# EAGLE design thermo (EAGLE 9.6.1)
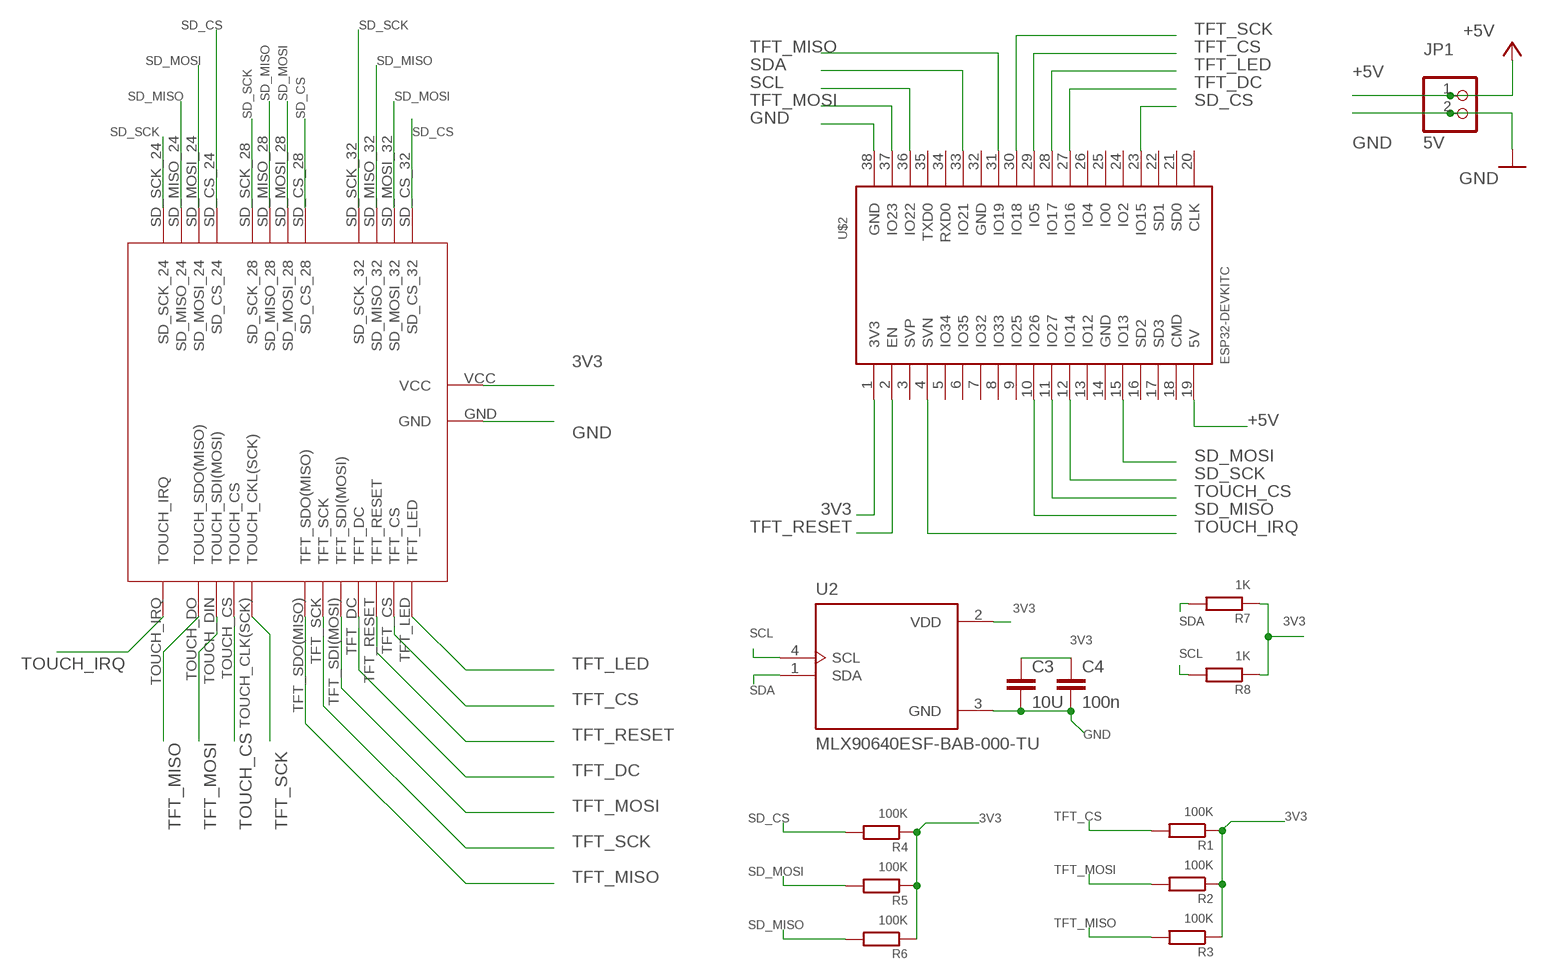
[diagram p0: schematic, sheet 1]

## Parts
C3  10U  C2,5-3  [C2.5-3]
C4  100n  C2,5-3  [C2.5-3]
JP1  5V  PINHD-1X2  [1X02]
R1  100K  R-EU_0204/7  [0204/7]
R2  100K  R-EU_0204/7  [0204/7]
R3  100K  R-EU_0204/7  [0204/7]
R4  100K  R-EU_0204/7  [0204/7]
R5  100K  R-EU_0204/7  [0204/7]
R6  100K  R-EU_0204/7  [0204/7]
R7  1K  R-EU_0204/7  [0204/7]
R8  1K  R-EU_0204/7  [0204/7]
U2  MLX90640ESF-BAB-000-TU  [TO292P945H1165-4]
U$2  ESP32DEVKITC  [ESP32-DEVKITC]
U$3  ILI9341_DISPLAY_SD_MODULE  [ILI9341_DISPLAY_SD_MODULE]

## Nets
3V3 [supply]: C3.1 C4.1 R1.1 R2.1 R3.1 R4.1 R5.1 R6.1 R7.1 R8.1 U2.2(VDD) U$2.1(3V3) U$3.VCC
+5V [supply]: JP1.1 U$2.19(5V)
GND [supply]: C3.2 C4.2 JP1.2 U2.3(GND) U$2.38(GND) U$3.GND
SCL: R8.2 U2.4(SCL) U$2.36(IO22)
SD_CS: R4.2 U$2.23(IO15) U$3.SD_CS_24 U$3.SD_CS_28 U$3.SD_CS_32
SD_MISO: R6.2 U$2.10(IO26) U$3.SD_MISO_24 U$3.SD_MISO_28 U$3.SD_MISO_32
SD_MOSI: R5.2 U$2.15(IO13) U$3.SD_MOSI_24 U$3.SD_MOSI_28 U$3.SD_MOSI_32
SD_SCK: U$2.12(IO14) U$3.SD_SCK_24 U$3.SD_SCK_28 U$3.SD_SCK_32
SDA: R7.2 U2.1(SDA) U$2.33(IO21)
TFT_CS: R1.2 U$2.29(IO5) U$3.TFT_CS
TFT_DC: U$2.27(IO16) U$3.TFT_DC
TFT_LED: U$2.28(IO17) U$3.TFT_LED
TFT_MISO: R3.2 U$2.31(IO19) U$3.TFT_SDO(MISO) U$3.TOUCH_DO(TOUCH_SDO(MISO))
TFT_MOSI: R2.2 U$2.37(IO23) U$3.TFT_SDI(MOSI) U$3.TOUCH_DIN(TOUCH_SDI(MOSI))
TFT_RESET: U$2.2(EN) U$3.TFT_RESET
TFT_SCK: U$2.30(IO18) U$3.TFT_SCK U$3.TOUCH_CLK(SCK)(TOUCH_CKL(SCK))
TOUCH_CS: U$2.11(IO27) U$3.TOUCH_CS
TOUCH_IRQ: U$2.4(SVN) U$3.TOUCH_IRQ
Unconnected: U$2.3(SVP) U$2.5(IO34) U$2.6(IO35) U$2.7(IO32) U$2.8(IO33) U$2.9(IO25) U$2.13(IO12) U$2.14(GND) U$2.16(SD2) U$2.17(SD3) U$2.18(CMD) U$2.20(CLK) U$2.21(SD0) U$2.22(SD1) U$2.24(IO2) U$2.25(IO0) U$2.26(IO4) U$2.32(GND) U$2.34(RXD0) U$2.35(TXD0)

## Library data of the parts
C3 C4 = capacitor-wima:C: CAPACITOR naming: grid - package width
JP1 = pinhead:PINHD-1X2: PIN HEADER
R1-R8 = rcl:R-EU_: RESISTOR, European symbol; SPICEPREFIX: R
U2 = teploblinEkran:MLX90640ESF-BAB-000-TU: SENSOR DGTL -40C-85C TO39; AVAILABILITY: Unavailable; DESCRIPTION: Thermal Image Sensor 32H x 24V TO-39; MF: Melexis Technologies NV; MP: MLX90640ESF-BAB-000-TU; PACKAGE: TO-39 Melexis Technologies NV; PRICE: None
U$2 = teploblinEkran:ESP32DEVKITC
U$3 = thermo:ILI9341_DISPLAY_SD_MODULE

## Net classes
1 supply: width 0.813 mm

## Board
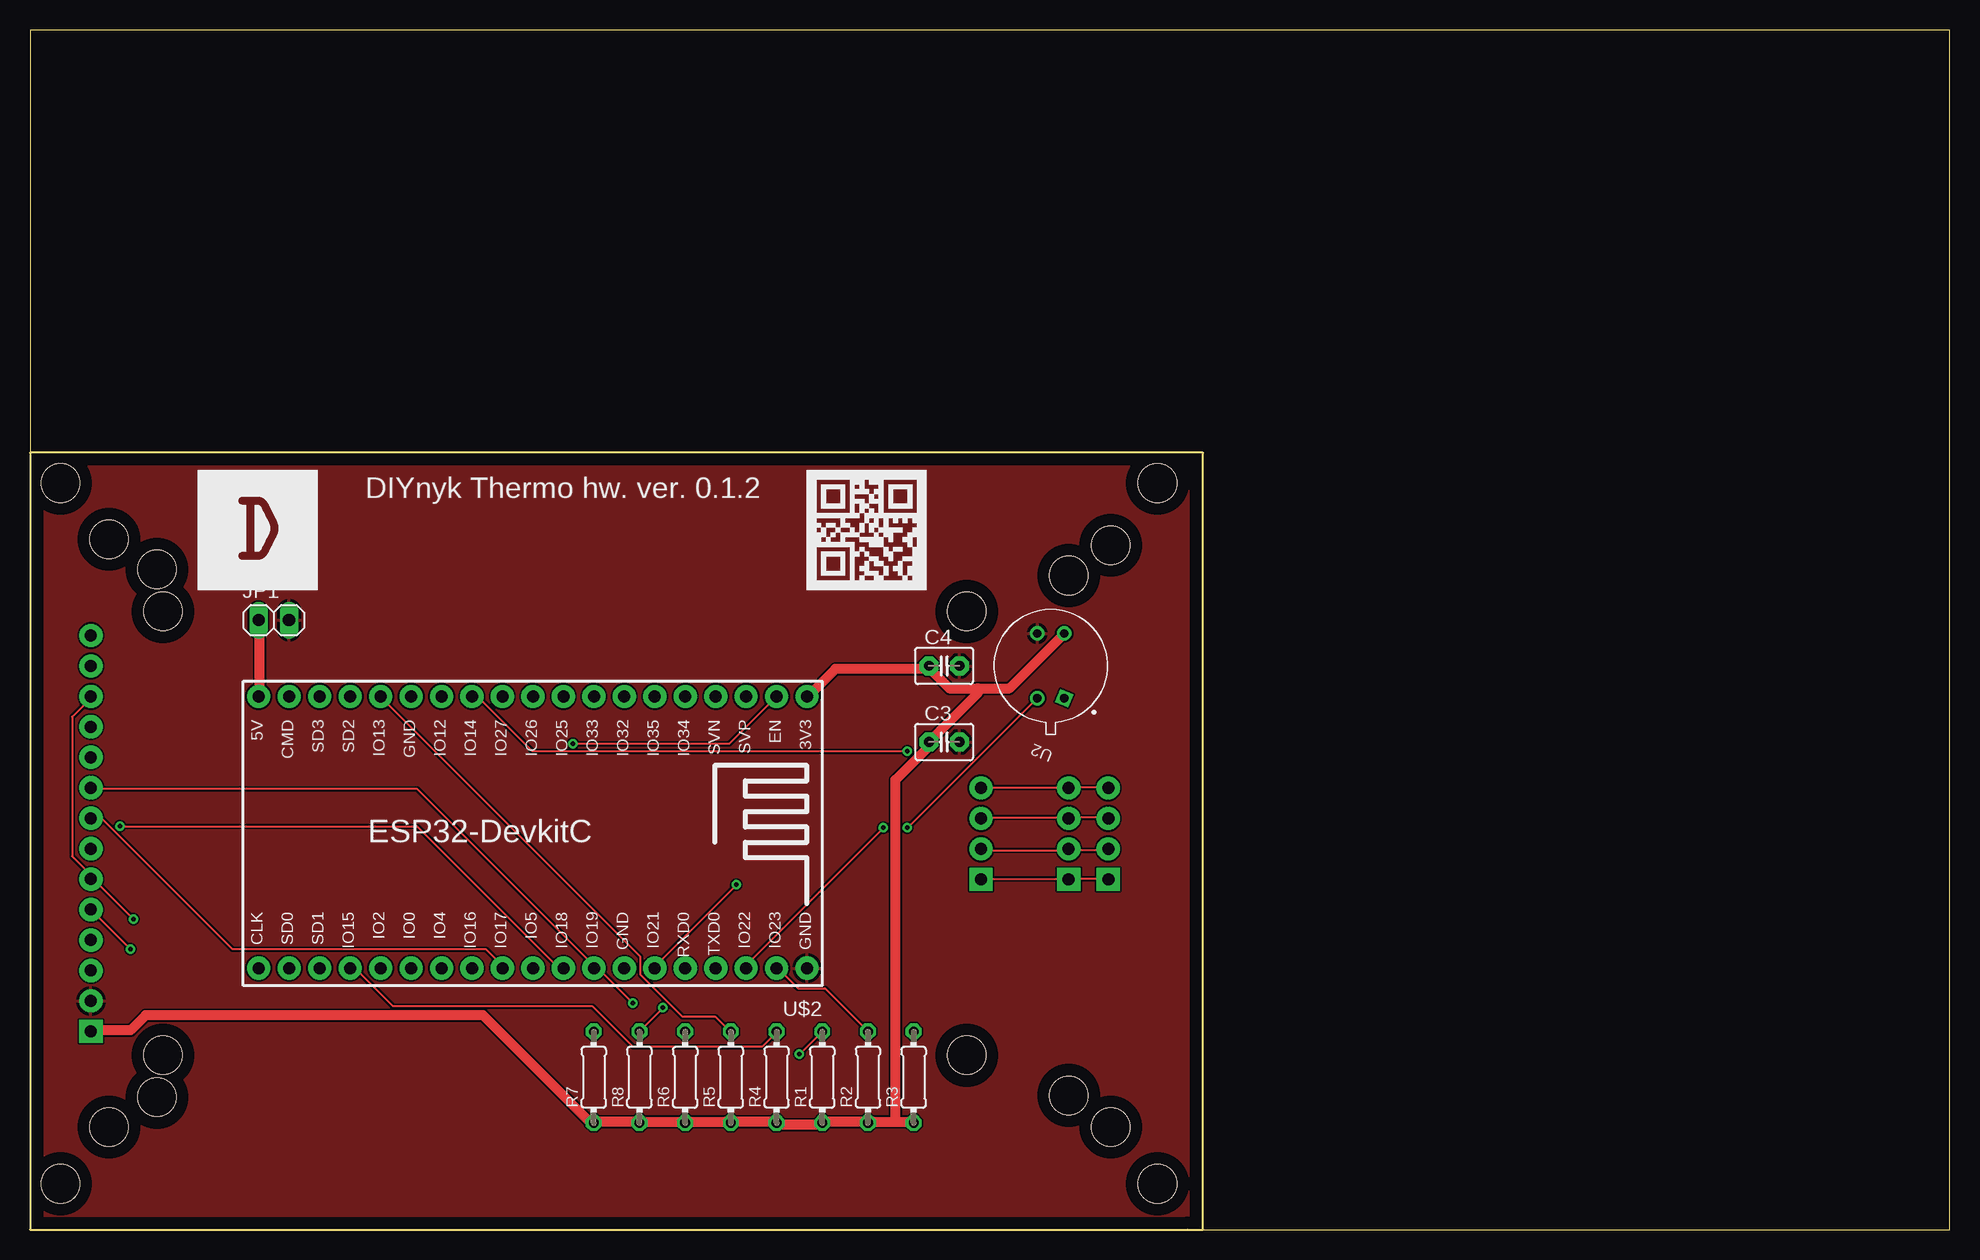
[diagram p1: board, top side]
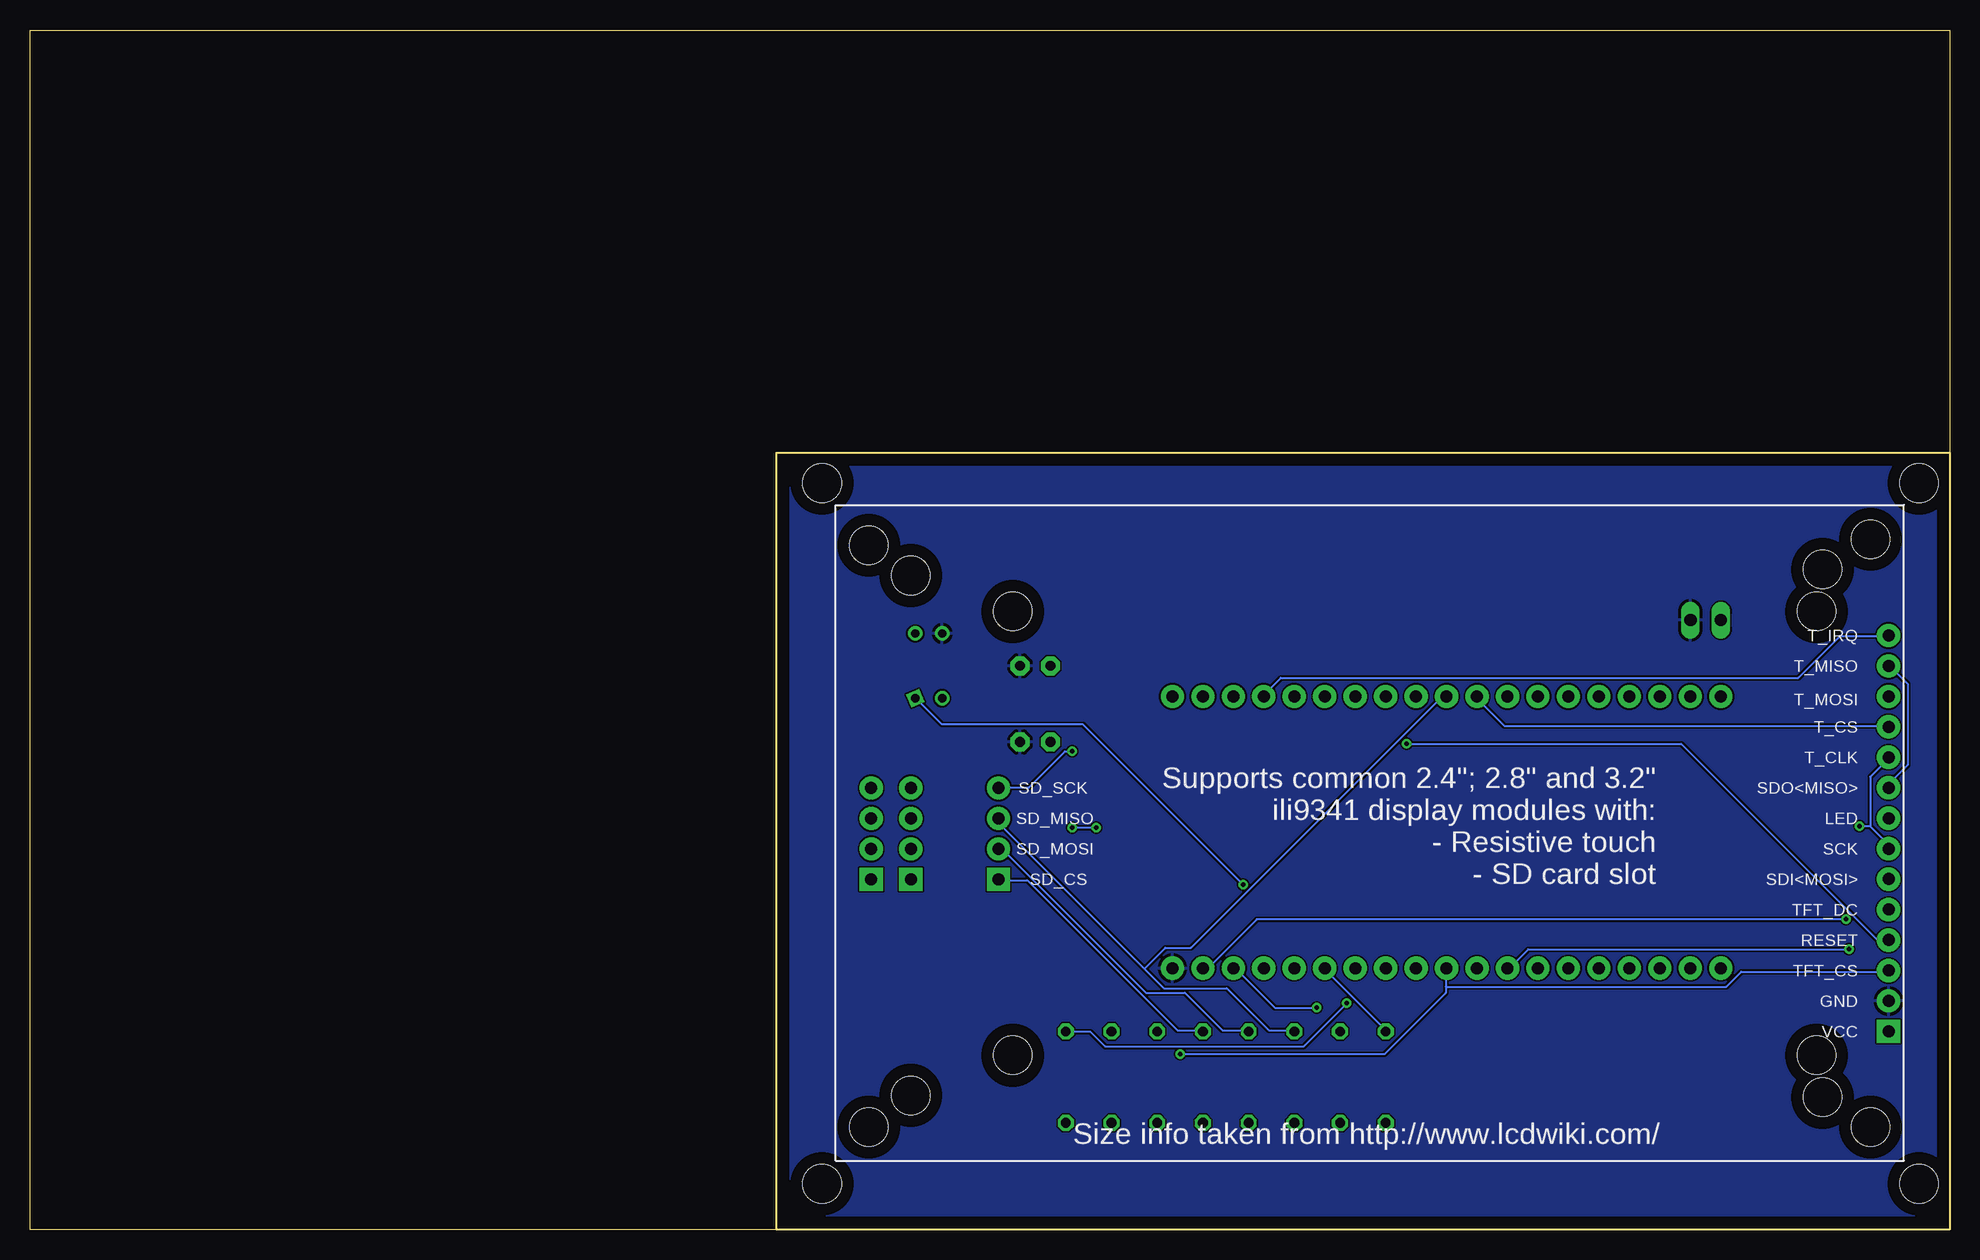
[diagram p2: board, bottom side, seen from below]

Size 160 x 100 mm. Coordinates in mm from the lower left corner, seen from the top.
Outline: 96.52,0 160,0 160,100 0,100 0,64.77
Outline: 96.52,0 0,0 0,64.77
Outline: 96.52,0 97.79,0 97.79,64.77 0,64.77
Copper layers (1*16): Top 0.035mm / dielectric 1.5mm / Bottom 0.035mm
Design rules "default": minimum track width 6mil, minimum drill 0.35mm, track to track 6mil, track to pad 6mil, pad to pad 6mil, via to via 6mil, smd to smd 6mil, copper to edge 40mil, drill to drill 6mil, minimum pad ring 10mil, minimum via ring 8mil, stop-mask expansion 4mil, vias tented up to drill 0mil, thermal gap 10mil
Holes 3.2 mm at 2.54,3.81 93.98,3.81 93.98,62.23 2.54,62.23

### Footprints (pad centres in the part's own frame; a part is rotated, then mirrored left to right if it is on the bottom)
C2.5-3 = drill 0.813 pad 1.6 octagon: 1 -1.27,0; 2 1.27,0
1X02 = drill 1.016 long: 1 -1.27,0; 2 1.27,0
0204/7 = drill 0.813 octagon: 1 -3.81,0; 2 3.81,0
TO292P945H1165-4 = drill 0.7 pad 1.1 square: 1 -2.065,2.067 | drill 0.7 pad 1.1: 2 0,-2.92; 3 2.065,-2.065; 4 0,2.92
ESP32-DEVKITC = drill 1 pad 1.93: 1 -22.87,-11.42; 2 -20.33,-11.42; 3 -17.79,-11.42; 4 -15.25,-11.42; 5 -12.71,-11.42; 6 -10.17,-11.42; 7 -7.63,-11.42; 8 -5.09,-11.42; 9 -2.55,-11.42; 10 -0.01,-11.42; 11 2.53,-11.42; 12 5.07,-11.42; 13 7.61,-11.42; 14 10.15,-11.42; 15 12.69,-11.42; 16 15.23,-11.42; 17 17.77,-11.42; 18 20.31,-11.42; 19 22.85,-11.42; 20 22.85,11.23; 21 20.31,11.23; 22 17.77,11.23; 23 15.23,11.23; 24 12.69,11.23; 25 10.15,11.23; 26 7.61,11.23; 27 5.07,11.23; 28 2.53,11.23; 29 -0.01,11.23; 30 -2.55,11.23; 31 -5.09,11.23; 32 -7.63,11.23; 33 -10.17,11.23; 34 -12.71,11.23; 35 -15.25,11.23; 36 -17.79,11.23; 37 -20.33,11.23; 38 -22.87,11.23
ILI9341_DISPLAY_SD_MODULE = drill 1 pad 1.93: GND -30.48,0; SD_MISO_24 -15.26,74.18; SD_MISO_28 -15.26,81.5; SD_MISO_32 -15.26,84.8; SD_MOSI_24 -17.8,74.18; SD_MOSI_28 -17.8,81.5; SD_MOSI_32 -17.8,84.8; SD_SCK_24 -12.72,74.18; SD_SCK_28 -12.72,81.5; SD_SCK_32 -12.72,84.8; TFT_CS -27.94,0; TFT_DC -22.86,0; TFT_LED -15.24,0; TFT_RESET -25.4,0; TFT_SCK -17.78,0; TFT_SDI(MOSI) -20.32,0; TFT_SDO(MISO) -12.7,0; TOUCH_CLK(SCK) -10.16,0; TOUCH_CS -7.62,0; TOUCH_DIN -5.08,0; TOUCH_DO -2.54,0; TOUCH_IRQ -0.02,0 | drill 1 pad 1.93 square: SD_CS_24 -20.34,74.18; SD_CS_28 -20.34,81.5; SD_CS_32 -20.34,84.8; VCC -33,0 | hole 3.2: 8.01,1.5; -40.99,1.5; -40.99,85; 7.51,85; 4.99,81.5; -38.35,81.5; -38.5,5.5; 5.5,5.5; -35,6; 2,6; -35,73; 2,73

### Placement (x,y rotation side)
C3  76.2,40.64 0 top
C4  76.2,46.99 0 top
JP1  20.32,50.8 0 top
R1  66.04,12.7 90 top
R2  69.85,12.7 90 top
R3  73.66,12.7 90 top
R4  62.23,12.7 90 top
R5  58.42,12.7 90 top
R6  54.61,12.7 90 top
R7  46.99,12.7 90 top
R8  50.8,12.7 90 top
U2  85.09,46.99 157.5 top
U$1  [DIYNYK_10MM]  13.97,53.34 0 top
U$2  41.91,33.02 180 top
U$3  5.08,49.53 90 bottom
U$4  [QR_10MM]  64.77,53.34 0 top

### Tracks (layer width: path | path; a pad name or v marks a point on that pad's centre or on a via)
3V3
  Top 0.813: 79,45.12 76.62,45.12 74.88,46.88 C4.1 74.5,46.75 67.12,46.75 64.88,44.5 U$2.1 | 79,45.12 81.62,45.12 86.12,49.62 U2.2 | 79,45.12 79,44.75 75,40.75 C3.1 74.88,40.25 72.12,37.5 72.12,9 | 72.12,9 70.25,9 R2.1 69.75,9 66.12,9 R1.1 65.75,8.75 62.62,8.75 R4.1 62.12,9 58.5,9 R5.1 58,9 55,9 R6.1 54.5,9 51.12,9 R8.1 50.75,9 47,9 R7.1 46.62,9 37.75,17.88 9.62,17.88 8.38,16.62 5.12,16.62 U$3.VCC | 72.12,9 73.62,9 R3.1
+5V
  Top 0.813: JP1.1 19.12,50.75 19.12,44.5 U$2.19
GND
  pour Top: -3.81,67.31 -3.81,-3.81 101.6,-3.81 101.6,68.58 -3.81,68.58
  pour Bottom: -6.35,69.85 -6.35,-6.35 104.14,-6.35 104.14,71.12 -6.35,71.12
SCL  (via drill 0.35)
  Top 0.152: v73.12,33.5 83.88,44.25 U2.4 | v71.12,33.5 59.75,22.12 59.75,21.88 U$2.36 | v52.75,18.5 50.88,16.62 R8.2
  Bottom 0.152: v71.12,33.5 v73.12,33.5 | v52.75,18.5 56.25,18.5 59.62,21.88 U$2.36
SD_CS
  Top 0.152: U$3.SD_CS_32 89.88,29.25 86.62,29.25 U$3.SD_CS_28 86.5,29.25 79.38,29.25 U$3.SD_CS_24 | U$2.23 26.75,21.75 27.12,21.75 30.25,18.62 46.88,18.62 50.25,15.25 61,15.25 62.25,16.5 R4.2
  Bottom 0.152: R4.2 62.25,16.62 64.38,16.62 76.88,29.12 79.25,29.12 U$3.SD_CS_24
SD_MISO
  Top 0.152: U$3.SD_MISO_32 89.88,34.38 86.62,34.38 U$3.SD_MISO_28 86.5,34.38 79.38,34.38 U$3.SD_MISO_24
  Bottom 0.152: 67.12,21.75 79.25,33.88 79.25,34.25 U$3.SD_MISO_24 | 67.12,21.75 65.5,20.12 60.25,20.12 56.75,16.62 54.62,16.62 R6.2 | 67.12,21.75 65.38,23.5 63.25,23.5 42.38,44.38 42,44.38 U$2.10
SD_MOSI
  Top 0.152: U$3.SD_MOSI_32 89.88,31.62 86.62,31.62 U$3.SD_MOSI_28 86.5,31.62 79.38,31.62 U$3.SD_MOSI_24 | U$2.15 29.25,44.38 50.88,22.75 50.88,21.25 54.38,17.75 57.12,17.75 58.38,16.5 R5.2
  Bottom 0.152: R5.2 58.5,16.62 60.62,16.62 63.75,19.75 67,19.75 78.88,31.62 79.25,31.62 U$3.SD_MOSI_24
SD_SCK  (via drill 0.35)
  Top 0.152: U$3.SD_SCK_32 89.88,36.88 86.62,36.88 U$3.SD_SCK_28 86.5,36.88 79.38,36.88 U$3.SD_SCK_24 | v73.12,39.88 41.88,39.88 37.38,44.38 36.88,44.38 U$2.12
  Bottom 0.152: v73.12,39.88 73.75,39.88 76.75,36.88 79.25,36.88 U$3.SD_SCK_24
SDA  (via drill 0.35)
  Top 0.152: v58.88,28.75 52,21.88 U$2.33
  Bottom 0.152: v58.88,28.75 72.25,42.12 84,42.12 86.12,44.25 U2.1 | R7.2 47,16.62 52.12,21.75 U$2.33
TFT_CS  (via drill 0.35)
  Top 0.152: v64.12,14.62 66,16.5 R1.2
  Bottom 0.152: v64.12,14.62 47.12,14.62 42,19.75 42,20.25 | 42,20.25 42,21.75 U$2.29 | 42,20.25 18.62,20.25 17.38,21.5 5.12,21.5 U$3.TFT_CS
TFT_DC  (via drill 0.35)
  Top 0.152: v8.38,23.38 U$3.TFT_DC
  Bottom 0.152: v8.38,23.38 35.12,23.38 36.75,21.75 U$2.27
TFT_LED
  Top 0.152: U$3.TFT_LED 5.12,34.25 6,34.25 16.88,23.38 38,23.38 39.5,21.88 U$2.28
TFT_MISO  (via drill 0.35)
  Top 0.152: v50.25,18.88 47.38,21.75 47.25,21.75 | 47.25,21.75 47,21.75 U$2.31 47.25,21.75 | 47.25,21.75 32.25,36.75 5.12,36.75 U$3.TFT_SDO(MISO)
  Bottom 0.152: U$3.TFT_SDO(MISO) 5,36.88 5,37.25 3.5,38.75 3.5,45.5 5,47 U$3.TOUCH_DO | v50.25,18.88 53.88,15.25 70.38,15.25 71.62,16.5 73.62,16.5 R3.2
TFT_MOSI  (via drill 0.35)
  Top 0.152: R2.2 69.75,16.62 66.25,20.12 64,20.12 62.25,21.88 U$2.37 | 5,29.5 5,29.62 3.5,31.12 3.5,42.75 5.12,44.38 U$3.TOUCH_DIN | 5,29.5 5,29.25 U$3.TFT_SDI(MOSI) 5,29.5 | 5,29.5 v8.62,25.88
  Bottom 0.152: v8.62,25.88 57.75,25.88 61.75,21.88 62.12,21.88 U$2.37
TFT_RESET  (via drill 0.35)
  Top 0.152: v45.25,40.5 58.25,40.5 62.12,44.38 U$2.2
  Bottom 0.152: v45.25,40.5 22.38,40.5 6.12,24.25 5.12,24.25 U$3.TFT_RESET
TFT_SCK  (via drill 0.35)
  Top 0.152: v7.5,33.62 32.25,33.62 44,21.88 44.38,21.88 U$2.30
  Bottom 0.152: 6.62,33.62 5.12,32.12 5.12,31.75 U$3.TFT_SCK | 6.62,33.62 6.62,37.75 5.12,39.25 U$3.TOUCH_CLK(SCK) | 6.62,33.62 v7.5,33.62
TOUCH_CS
  Bottom 0.152: U$3.TOUCH_CS 5.12,42 37.12,42 39.5,44.38 U$2.11
TOUCH_IRQ
  Bottom 0.152: U$3.TOUCH_IRQ 5.12,49.5 9.12,49.5 12.62,46 55.75,46 57.25,44.5 U$2.4

### Text on the board
tPlace: DIYnyk Thermo hw. ver. 0.1.2